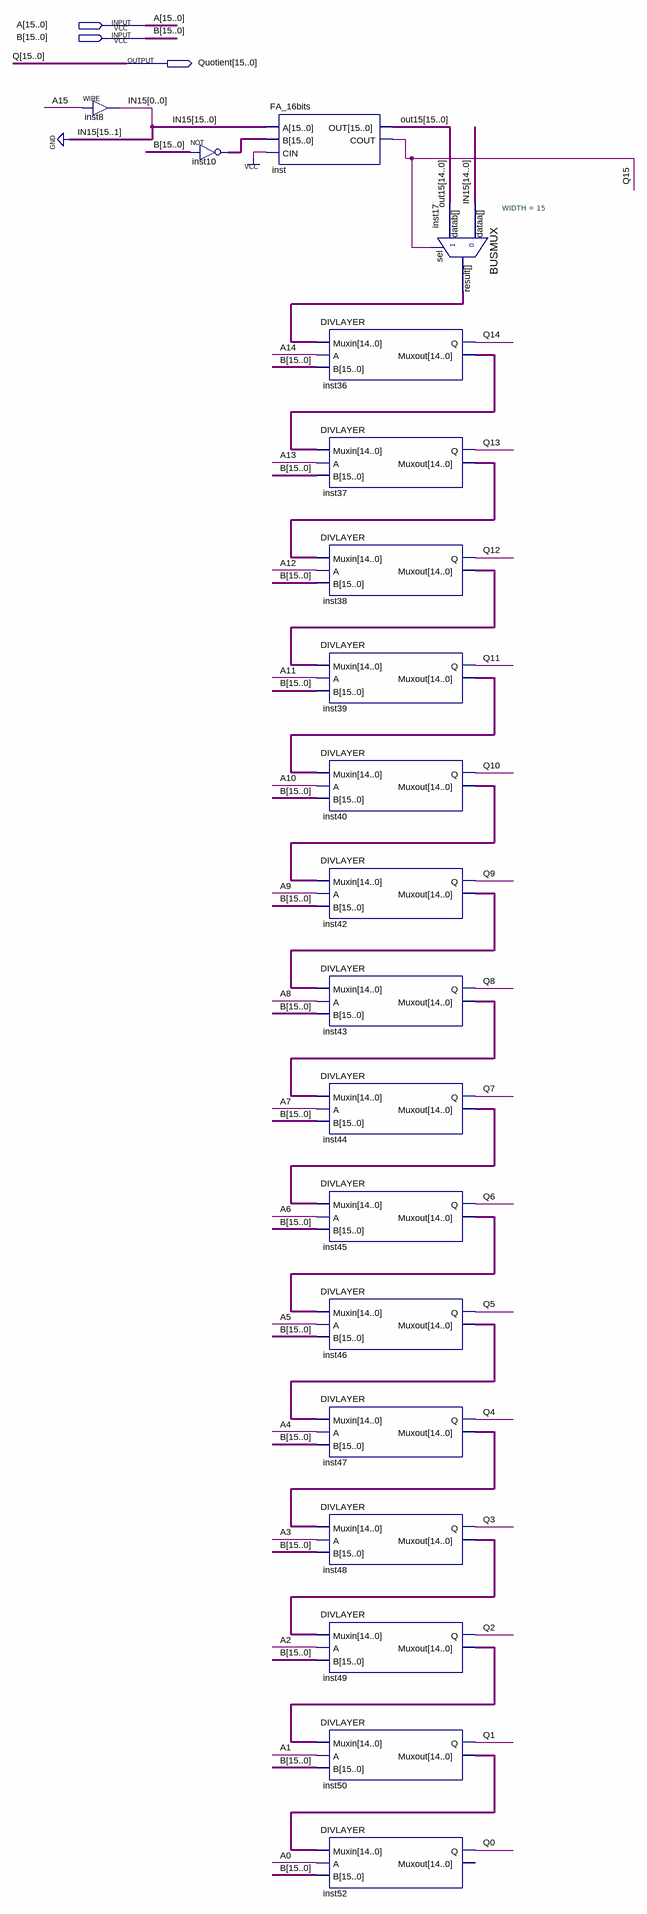
[diagram p0: schematic sheet]
// Quartus schematic DIV.bdf as structural Verilog: 19 symbols, 3 pins
module DIV (
  input  [15:0] A,
  input  [15:0] B,
  output [15:0] Quotient
);

  wire [0:0] IN15;
  wire [14:0] inst17_result, inst36_muxout, inst37_muxout, inst38_muxout, inst39_muxout, inst40_muxout,
       inst42_muxout, inst43_muxout, inst44_muxout, inst45_muxout, inst46_muxout, inst47_muxout,
       inst48_muxout, inst49_muxout, inst50_muxout;
  wire [15:0] inst10_out, out15;

  assign IN15[0] = A[15];  // WIRE inst8
  assign inst10_out = ~B;  // NOT inst10, 16 bits wide
  FA_16bits inst (.A({{15{1'b0}}, IN15[0]}), .B(inst10_out), .CIN(1'b1), .OUT(out15), .COUT(Quotient[15]));
  DIVLAYER inst36 (.Muxin(inst17_result), .A(A[14]), .B(B), .Q(Quotient[14]), .Muxout(inst36_muxout));
  DIVLAYER inst37 (.Muxin(inst36_muxout), .A(A[13]), .B(B), .Q(Quotient[13]), .Muxout(inst37_muxout));
  DIVLAYER inst38 (.Muxin(inst37_muxout), .A(A[12]), .B(B), .Q(Quotient[12]), .Muxout(inst38_muxout));
  DIVLAYER inst39 (.Muxin(inst38_muxout), .A(A[11]), .B(B), .Q(Quotient[11]), .Muxout(inst39_muxout));
  DIVLAYER inst40 (.Muxin(inst39_muxout), .A(A[10]), .B(B), .Q(Quotient[10]), .Muxout(inst40_muxout));
  DIVLAYER inst42 (.Muxin(inst40_muxout), .A(A[9]), .B(B), .Q(Quotient[9]), .Muxout(inst42_muxout));
  DIVLAYER inst43 (.Muxin(inst42_muxout), .A(A[8]), .B(B), .Q(Quotient[8]), .Muxout(inst43_muxout));
  DIVLAYER inst44 (.Muxin(inst43_muxout), .A(A[7]), .B(B), .Q(Quotient[7]), .Muxout(inst44_muxout));
  DIVLAYER inst45 (.Muxin(inst44_muxout), .A(A[6]), .B(B), .Q(Quotient[6]), .Muxout(inst45_muxout));
  DIVLAYER inst46 (.Muxin(inst45_muxout), .A(A[5]), .B(B), .Q(Quotient[5]), .Muxout(inst46_muxout));
  DIVLAYER inst47 (.Muxin(inst46_muxout), .A(A[4]), .B(B), .Q(Quotient[4]), .Muxout(inst47_muxout));
  DIVLAYER inst48 (.Muxin(inst47_muxout), .A(A[3]), .B(B), .Q(Quotient[3]), .Muxout(inst48_muxout));
  DIVLAYER inst49 (.Muxin(inst48_muxout), .A(A[2]), .B(B), .Q(Quotient[2]), .Muxout(inst49_muxout));
  DIVLAYER inst50 (.Muxin(inst49_muxout), .A(A[1]), .B(B), .Q(Quotient[1]), .Muxout(inst50_muxout));
  DIVLAYER inst52 (.Muxin(inst50_muxout), .A(A[0]), .B(B), .Q(Quotient[0]));  // open: Muxout
  BUSMUX #(.WIDTH(15)) inst17 (
    .datab(out15[14:0]), .sel(Quotient[15]), .dataa({{14{1'b0}}, IN15[0]}), .result(inst17_result));

  // Other names for the same wires on the sheet: Q[15:0] = Quotient; Q0 = Quotient[0]; Q1 = Quotient[1];
  //   Q2 = Quotient[2]; Q3 = Quotient[3]; Q4 = Quotient[4]; Q5 = Quotient[5]; Q6 = Quotient[6]; Q7 = Quotient[7];
  //   Q8 = Quotient[8]; Q9 = Quotient[9]; Q10 = Quotient[10]; Q11 = Quotient[11]; Q12 = Quotient[12];
  //   Q13 = Quotient[13]; Q14 = Quotient[14]; Q15 = Quotient[15]
endmodule
